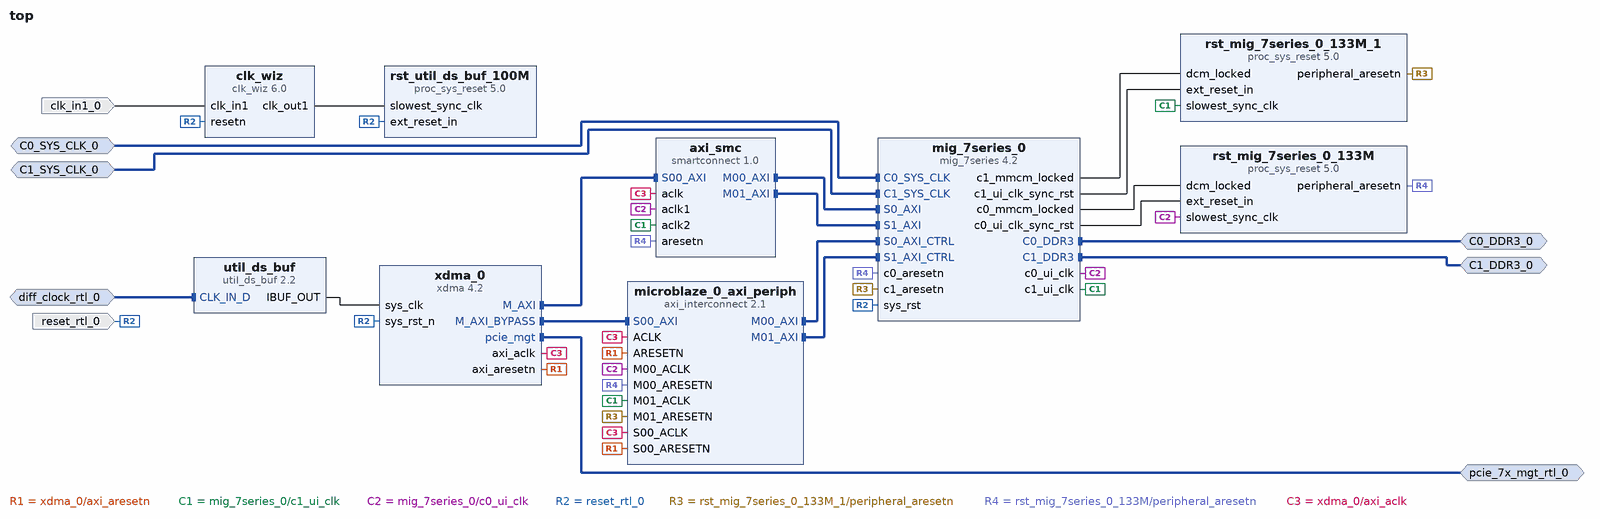
[diagram p0: block diagram of the top level]
# Vivado block design top, xc7k480tffg1156-2, Vivado 2025.2
create_bd_design top

create_bd_intf_port -mode Master -vlnv xilinx.com:interface:pcie_7x_mgt_rtl:1.0 pcie_7x_mgt_rtl_0
create_bd_intf_port -mode Slave -vlnv xilinx.com:interface:diff_clock_rtl:1.0 diff_clock_rtl_0
set_property -dict {CONFIG.FREQ_HZ 100000000} [get_bd_intf_ports diff_clock_rtl_0]
create_bd_intf_port -mode Slave -vlnv xilinx.com:interface:diff_clock_rtl:1.0 C0_SYS_CLK_0
create_bd_intf_port -mode Slave -vlnv xilinx.com:interface:diff_clock_rtl:1.0 C1_SYS_CLK_0
create_bd_intf_port -mode Master -vlnv xilinx.com:interface:ddrx_rtl:1.0 C0_DDR3_0
create_bd_intf_port -mode Master -vlnv xilinx.com:interface:ddrx_rtl:1.0 C1_DDR3_0
create_bd_port -dir I -type rst reset_rtl_0
set_property -dict {CONFIG.POLARITY ACTIVE_LOW} [get_bd_ports reset_rtl_0]
create_bd_port -dir I -type clk clk_in1_0
set_property -dict {CONFIG.FREQ_HZ 50000000} [get_bd_ports clk_in1_0]

create_bd_cell -type ip -vlnv xilinx.com:ip:mig_7series:4.2 mig_7series_0
set_property -dict [list \
  CONFIG.BOARD_MIG_PARAM Custom \
  CONFIG.RESET_BOARD_INTERFACE Custom \
  CONFIG.XML_INPUT_FILE mig_a.prj \
] [get_bd_cells mig_7series_0]
create_bd_cell -type ip -vlnv xilinx.com:ip:xdma:4.2 xdma_0
set_property -dict [list \
  CONFIG.PF0_DEVICE_ID_mqdma 9028 \
  CONFIG.PF0_SRIOV_VF_DEVICE_ID A038 \
  CONFIG.PF2_DEVICE_ID_mqdma 9228 \
  CONFIG.PF3_DEVICE_ID_mqdma 9328 \
  CONFIG.axi_bypass_64bit_en true \
  CONFIG.axi_data_width 128_bit \
  CONFIG.axist_bypass_en true \
  CONFIG.axisten_freq 250 \
  CONFIG.enable_gtwizard false \
  CONFIG.mode_selection Basic \
  CONFIG.pcie_extended_tag true \
  CONFIG.pcie_id_if false \
  CONFIG.pf0_base_class_menu Memory_controller \
  CONFIG.pf0_class_code_base 05 \
  CONFIG.pf0_class_code_interface 00 \
  CONFIG.pf0_class_code_sub 80 \
  CONFIG.pf0_device_id 7028 \
  CONFIG.pf0_interrupt_pin NONE \
  CONFIG.pf0_msix_cap_pba_offset 00008FE0 \
  CONFIG.pf0_msix_cap_table_offset 00008000 \
  CONFIG.pf0_msix_cap_table_size 01F \
  CONFIG.pf0_msix_enabled true \
  CONFIG.pf0_sub_class_interface_menu Other_memory_controller \
  CONFIG.pl_link_cap_max_link_speed 5.0_GT/s \
  CONFIG.pl_link_cap_max_link_width X8 \
  CONFIG.xdma_axi_intf_mm AXI_Memory_Mapped \
  CONFIG.xdma_pcie_64bit_en false \
  CONFIG.xdma_rnum_chnl 2 \
  CONFIG.xdma_wnum_chnl 2 \
] [get_bd_cells xdma_0]
create_bd_cell -type ip -vlnv xilinx.com:ip:util_ds_buf:2.2 util_ds_buf
set_property -dict {CONFIG.C_BUF_TYPE IBUFDSGTE} [get_bd_cells util_ds_buf]
create_bd_cell -type ip -vlnv xilinx.com:ip:axi_interconnect:2.1 microblaze_0_axi_periph
set_property -dict {CONFIG.NUM_MI 2} [get_bd_cells microblaze_0_axi_periph]
create_bd_cell -type ip -vlnv xilinx.com:ip:smartconnect:1.0 axi_smc
set_property -dict {CONFIG.NUM_CLKS 3 CONFIG.NUM_MI 2 CONFIG.NUM_SI 1} [get_bd_cells axi_smc]
create_bd_cell -type ip -vlnv xilinx.com:ip:proc_sys_reset:5.0 rst_mig_7series_0_133M
create_bd_cell -type ip -vlnv xilinx.com:ip:proc_sys_reset:5.0 rst_mig_7series_0_133M_1
create_bd_cell -type ip -vlnv xilinx.com:ip:clk_wiz:6.0 clk_wiz
set_property -dict [list \
  CONFIG.CLKIN1_JITTER_PS 200.0 \
  CONFIG.CLKOUT1_JITTER 162.035 \
  CONFIG.CLKOUT1_PHASE_ERROR 164.985 \
  CONFIG.CLKOUT1_REQUESTED_OUT_FREQ 100.000 \
  CONFIG.MMCM_CLKFBOUT_MULT_F 20.000 \
  CONFIG.MMCM_CLKIN1_PERIOD 20.000 \
  CONFIG.MMCM_CLKIN2_PERIOD 10.0 \
  CONFIG.MMCM_CLKOUT0_DIVIDE_F 10.000 \
  CONFIG.RESET_PORT resetn \
  CONFIG.RESET_TYPE ACTIVE_LOW \
  CONFIG.USE_LOCKED false \
  CONFIG.USE_RESET true \
] [get_bd_cells clk_wiz]
create_bd_cell -type ip -vlnv xilinx.com:ip:proc_sys_reset:5.0 rst_util_ds_buf_100M

# ---- connections ----

connect_bd_intf_net -intf_net C0_SYS_CLK_0_1 [get_bd_intf_ports C0_SYS_CLK_0] [get_bd_intf_pins mig_7series_0/C0_SYS_CLK]
connect_bd_intf_net -intf_net C1_SYS_CLK_0_1 [get_bd_intf_ports C1_SYS_CLK_0] [get_bd_intf_pins mig_7series_0/C1_SYS_CLK]
connect_bd_intf_net [get_bd_intf_pins axi_smc/M00_AXI] [get_bd_intf_pins mig_7series_0/S0_AXI]
connect_bd_intf_net [get_bd_intf_pins axi_smc/M01_AXI] [get_bd_intf_pins mig_7series_0/S1_AXI]
connect_bd_intf_net -intf_net diff_clock_rtl_0_1 [get_bd_intf_ports diff_clock_rtl_0] [get_bd_intf_pins util_ds_buf/CLK_IN_D]
connect_bd_intf_net [get_bd_intf_pins mig_7series_0/S0_AXI_CTRL] [get_bd_intf_pins microblaze_0_axi_periph/M00_AXI]
connect_bd_intf_net [get_bd_intf_pins mig_7series_0/S1_AXI_CTRL] [get_bd_intf_pins microblaze_0_axi_periph/M01_AXI]
connect_bd_intf_net [get_bd_intf_ports C0_DDR3_0] [get_bd_intf_pins mig_7series_0/C0_DDR3]
connect_bd_intf_net [get_bd_intf_ports C1_DDR3_0] [get_bd_intf_pins mig_7series_0/C1_DDR3]
connect_bd_intf_net [get_bd_intf_pins xdma_0/M_AXI] [get_bd_intf_pins axi_smc/S00_AXI]
connect_bd_intf_net [get_bd_intf_pins xdma_0/M_AXI_BYPASS] [get_bd_intf_pins microblaze_0_axi_periph/S00_AXI]
connect_bd_intf_net [get_bd_intf_ports pcie_7x_mgt_rtl_0] [get_bd_intf_pins xdma_0/pcie_mgt]
connect_bd_net -net ARESETN_1 [get_bd_pins xdma_0/axi_aresetn] \
  [get_bd_pins microblaze_0_axi_periph/ARESETN] [get_bd_pins microblaze_0_axi_periph/S00_ARESETN]
connect_bd_net [get_bd_pins mig_7series_0/c1_ui_clk] \
  [get_bd_pins rst_mig_7series_0_133M_1/slowest_sync_clk] [get_bd_pins axi_smc/aclk2] \
  [get_bd_pins microblaze_0_axi_periph/M01_ACLK]
connect_bd_net -net clk_in1_0_1 [get_bd_ports clk_in1_0] [get_bd_pins clk_wiz/clk_in1]
connect_bd_net [get_bd_pins clk_wiz/clk_out1] [get_bd_pins rst_util_ds_buf_100M/slowest_sync_clk]
connect_bd_net [get_bd_pins mig_7series_0/c0_mmcm_locked] [get_bd_pins rst_mig_7series_0_133M/dcm_locked]
connect_bd_net [get_bd_pins mig_7series_0/c0_ui_clk] \
  [get_bd_pins microblaze_0_axi_periph/M00_ACLK] [get_bd_pins rst_mig_7series_0_133M/slowest_sync_clk] \
  [get_bd_pins axi_smc/aclk1]
connect_bd_net [get_bd_pins mig_7series_0/c0_ui_clk_sync_rst] [get_bd_pins rst_mig_7series_0_133M/ext_reset_in]
connect_bd_net [get_bd_pins mig_7series_0/c1_mmcm_locked] [get_bd_pins rst_mig_7series_0_133M_1/dcm_locked]
connect_bd_net [get_bd_pins mig_7series_0/c1_ui_clk_sync_rst] [get_bd_pins rst_mig_7series_0_133M_1/ext_reset_in]
connect_bd_net -net reset_rtl_0_1 [get_bd_ports reset_rtl_0] \
  [get_bd_pins clk_wiz/resetn] [get_bd_pins mig_7series_0/sys_rst] [get_bd_pins xdma_0/sys_rst_n] \
  [get_bd_pins rst_util_ds_buf_100M/ext_reset_in]
connect_bd_net [get_bd_pins rst_mig_7series_0_133M_1/peripheral_aresetn] \
  [get_bd_pins mig_7series_0/c1_aresetn] [get_bd_pins microblaze_0_axi_periph/M01_ARESETN]
connect_bd_net [get_bd_pins rst_mig_7series_0_133M/peripheral_aresetn] \
  [get_bd_pins axi_smc/aresetn] [get_bd_pins mig_7series_0/c0_aresetn] [get_bd_pins microblaze_0_axi_periph/M00_ARESETN]
connect_bd_net [get_bd_pins util_ds_buf/IBUF_OUT] [get_bd_pins xdma_0/sys_clk]
connect_bd_net [get_bd_pins xdma_0/axi_aclk] \
  [get_bd_pins axi_smc/aclk] [get_bd_pins microblaze_0_axi_periph/ACLK] [get_bd_pins microblaze_0_axi_periph/S00_ACLK]

# ---- address map ----
assign_bd_address -offset 0x0000000000000000 -range 2G -target_address_space [get_bd_addr_spaces xdma_0/M_AXI] [get_bd_addr_segs mig_7series_0/c0_memmap/c0_memaddr]
assign_bd_address -offset 0x0000000080000000 -range 2G -target_address_space [get_bd_addr_spaces xdma_0/M_AXI] [get_bd_addr_segs mig_7series_0/c1_memmap/c1_memaddr]
assign_bd_address -offset 0x0000000080000000 -range 1M -target_address_space [get_bd_addr_spaces xdma_0/M_AXI_BYPASS] [get_bd_addr_segs mig_7series_0/c0_s_axi_ctrl_memmap/c0_s_axi_ctrl_memaddr]
assign_bd_address -offset 0x0000000080100000 -range 1M -target_address_space [get_bd_addr_spaces xdma_0/M_AXI_BYPASS] [get_bd_addr_segs mig_7series_0/c1_s_axi_ctrl_memmap/c1_s_axi_ctrl_memaddr]

validate_bd_design
save_bd_design
